# EAGLE design bookie_board (EAGLE 5.06)
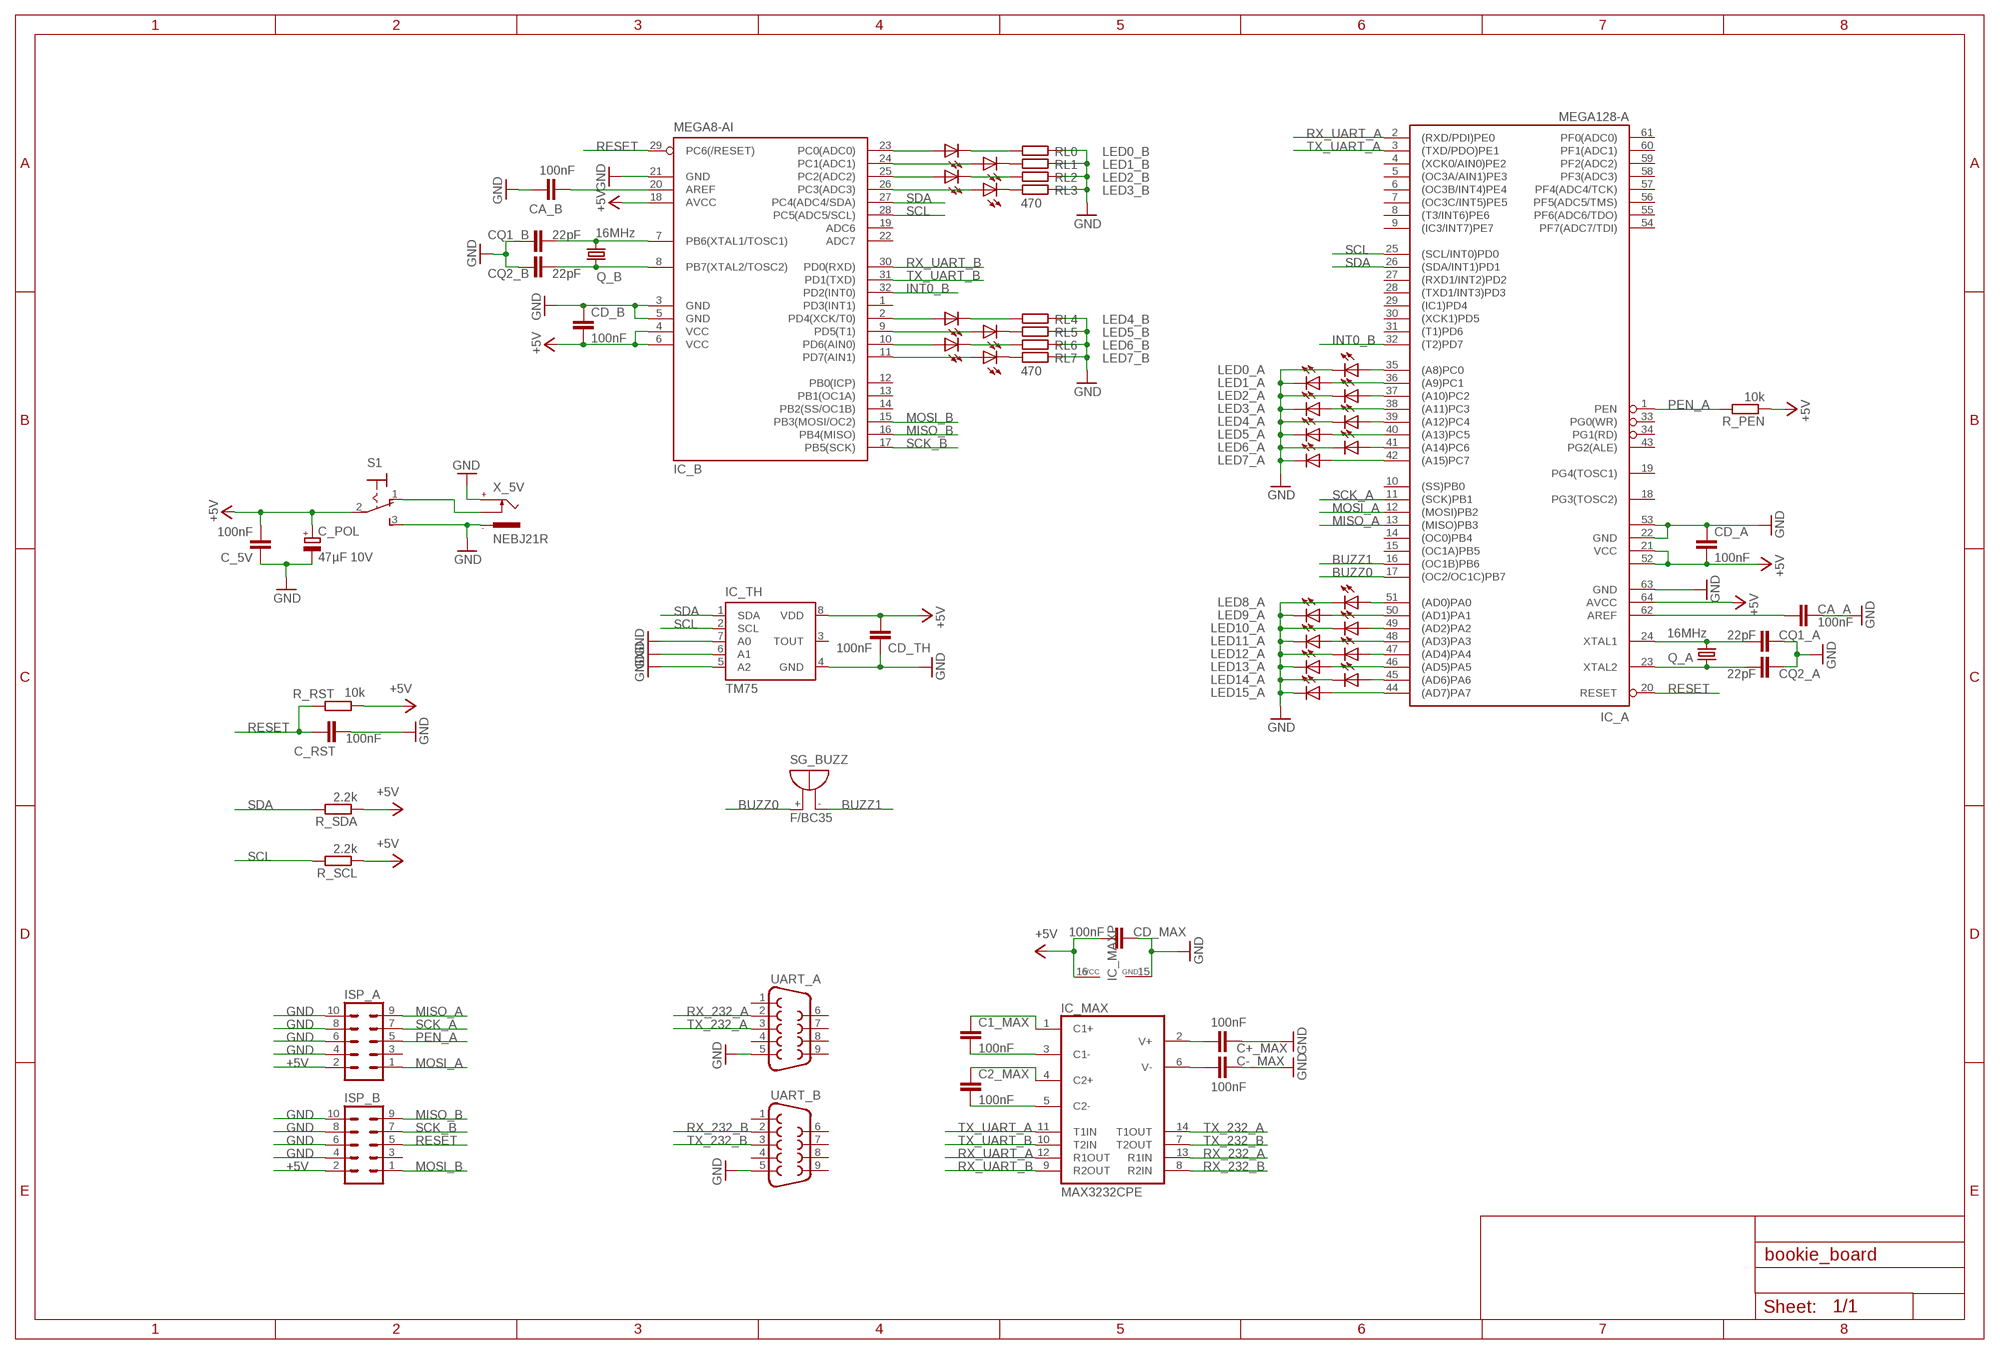
[diagram p0: schematic, sheet 1]

## Parts
C1_MAX  100nF  C-EUC0805  [C0805]
C2_MAX  100nF  C-EUC0805  [C0805]
C+_MAX  100nF  C-EUC0805  [C0805]
C-_MAX  100nF  C-EUC0805  [C0805]
C_5V  100nF  C-EUC0805  [C0805]
C_POL  47µF 10V  CPOL-EUE5-5  [E5-5]
C_RST  100nF  C-EUC0805  [C0805]
CA_A  100nF  C-EUC0805  [C0805]
CA_B  100nF  C-EUC0805  [C0805]
CD_A  100nF  C-EUC0805  [C0805]
CD_B  100nF  C-EUC0805  [C0805]
CD_MAX  100nF  C-EUC0805  [C0805]
CD_TH  100nF  C-EUC0805  [C0805]
CQ1_A  22pF  C-EUC0805  [C0805]
CQ1_B  22pF  C-EUC0805  [C0805]
CQ2_A  22pF  C-EUC0805  [C0805]
CQ2_B  22pF  C-EUC0805  [C0805]
IC_A  MEGA128-A  [TQFP64]
IC_B  MEGA8-AI  [TQFP32-08]
IC_MAX  MAX3232CPE  [DIL16]
IC_TH  DS1621S  [SO08]
ISP_A  ML10L  [ML10L]
ISP_B  ML10L  [ML10L]
LED0_A  LEDCHIPLED_1206  [CHIPLED_1206]
LED0_B  LEDCHIPLED_1206  [CHIPLED_1206]
LED1_A  LEDCHIPLED_1206  [CHIPLED_1206]
LED1_B  LEDCHIPLED_1206  [CHIPLED_1206]
LED2_A  LEDCHIPLED_1206  [CHIPLED_1206]
LED2_B  LEDCHIPLED_1206  [CHIPLED_1206]
LED3_A  LEDCHIPLED_1206  [CHIPLED_1206]
LED3_B  LEDCHIPLED_1206  [CHIPLED_1206]
LED4_A  LEDCHIPLED_1206  [CHIPLED_1206]
LED4_B  LEDCHIPLED_1206  [CHIPLED_1206]
LED5_A  LEDCHIPLED_1206  [CHIPLED_1206]
LED5_B  LEDCHIPLED_1206  [CHIPLED_1206]
LED6_A  LEDCHIPLED_1206  [CHIPLED_1206]
LED6_B  LEDCHIPLED_1206  [CHIPLED_1206]
LED7_A  LEDCHIPLED_1206  [CHIPLED_1206]
LED7_B  LEDCHIPLED_1206  [CHIPLED_1206]
LED8_A  LEDCHIPLED_1206  [CHIPLED_1206]
LED9_A  LEDCHIPLED_1206  [CHIPLED_1206]
LED10_A  LEDCHIPLED_1206  [CHIPLED_1206]
LED11_A  LEDCHIPLED_1206  [CHIPLED_1206]
LED12_A  LEDCHIPLED_1206  [CHIPLED_1206]
LED13_A  LEDCHIPLED_1206  [CHIPLED_1206]
LED14_A  LEDCHIPLED_1206  [CHIPLED_1206]
LED15_A  LEDCHIPLED_1206  [CHIPLED_1206]
Q_A  16MHz  CRYSTALHC49S  [HC49/S]
Q_B  16MHz  CRYSTALHC49S  [HC49/S]
R_PEN  10k  R-EU_M0805  [M0805]
R_RST  10k  R-EU_M0805  [M0805]
R_SCL  2.2k  R-EU_M0805  [M0805]
R_SDA  2.2k  R-EU_M0805  [M0805]
RL0  470  R-EU_M0805  [M0805]
RL1  470  R-EU_M0805  [M0805]
RL2  470  R-EU_M0805  [M0805]
RL3  470  R-EU_M0805  [M0805]
RL4  470  R-EU_M0805  [M0805]
RL5  470  R-EU_M0805  [M0805]
RL6  470  R-EU_M0805  [M0805]
RL7  470  R-EU_M0805  [M0805]
S1  M9040P  [M9040P]
SG_BUZZ  F/BC35  [F/BC35]
UART_A  F09D  [F09D]
UART_B  F09D  [F09D]
X_5V  NEBJ21R  [NEBJ21R]

## Nets
+5V: C_5V.2 C_POL.+ CD_A.1 CD_B.1 CD_MAX.1 CD_TH.2 IC_A.21(VCC) IC_A.52(VCC1) IC_A.64(AVCC) IC_B.4(VCC) IC_B.6(VCC) IC_B.18(AVCC) IC_MAX.16(VCC) IC_TH.8(VDD) ISP_A.2 ISP_B.2 R_PEN.1 R_RST.1 R_SCL.1 R_SDA.1 S1.2(P)
BUZZ0: IC_A.17((OC2/OC1C)PB7) SG_BUZZ.+
BUZZ1: IC_A.16((OC1B)PB6) SG_BUZZ.-
GND: C+_MAX.2 C-_MAX.1 C_5V.1 C_POL.- C_RST.1 CA_A.1 CA_B.2 CD_A.2 CD_B.2 CD_MAX.2 CD_TH.1 CQ1_A.2 CQ1_B.1 CQ2_A.1 CQ2_B.2 IC_A.22(GND) IC_A.53(GND1) IC_A.63(GND) IC_B.3(GND) IC_B.5(GND) IC_B.21(GND) IC_MAX.15(GND) IC_TH.4(GND) IC_TH.5(A2) IC_TH.6(A1) IC_TH.7(A0) ISP_A.4 ISP_A.6 ISP_A.8 ISP_A.10 ISP_B.4 ISP_B.6 ISP_B.8 ISP_B.10 LED0_A.C LED1_A.C LED2_A.C LED3_A.C LED4_A.C LED5_A.C LED6_A.C LED7_A.C LED8_A.C LED9_A.C LED10_A.C LED11_A.C LED12_A.C LED13_A.C LED14_A.C LED15_A.C RL0.1 RL1.1 RL2.1 RL3.1 RL4.1 RL5.1 RL6.1 RL7.1 S1.3(S) UART_A.5 UART_B.5 X_5V.+ X_5V.-
INT0_B: IC_A.32((T2)PD7) IC_B.32(PD2(INT0))
MISO_A: IC_A.13((MISO)PB3) ISP_A.9
MISO_B: IC_B.16(PB4(MISO)) ISP_B.9
MOSI_A: IC_A.12((MOSI)PB2) ISP_A.1
MOSI_B: IC_B.15(PB3(MOSI/OC2)) ISP_B.1
N$1: IC_A.51((AD0)PA0) LED8_A.A
N$2: IC_A.50((AD1)PA1) LED9_A.A
N$3: IC_A.49((AD2)PA2) LED10_A.A
N$4: IC_A.48((AD3)PA3) LED11_A.A
N$5: IC_A.47((AD4)PA4) LED12_A.A
N$6: IC_A.46((AD5)PA5) LED13_A.A
N$7: IC_A.45((AD6)PA6) LED14_A.A
N$8: IC_A.44((AD7)PA7) LED15_A.A
N$9: IC_B.26(PC3(ADC3)) LED3_B.A
N$10: IC_B.25(PC2(ADC2)) LED2_B.A
N$11: IC_B.24(PC1(ADC1)) LED1_B.A
N$12: IC_B.23(PC0(ADC0)) LED0_B.A
N$13: IC_B.2(PD4(XCK/T0)) LED4_B.A
N$14: IC_B.9(PD5(T1)) LED5_B.A
N$15: IC_B.10(PD6(AIN0)) LED6_B.A
N$16: C1_MAX.2 IC_MAX.3(C1-)
N$17: CQ1_A.1 IC_A.24(XTAL1) Q_A.2
N$18: CQ2_A.2 IC_A.23(XTAL2) Q_A.1
N$19: CQ1_B.2 IC_B.7(PB6(XTAL1/TOSC1)) Q_B.2
N$20: CQ2_B.1 IC_B.8(PB7(XTAL2/TOSC2)) Q_B.1
N$21: CA_A.2 IC_A.62(AREF)
N$22: CA_B.1 IC_B.20(AREF)
N$23: LED0_B.C RL0.2
N$24: LED2_B.C RL2.2
N$25: LED1_B.C RL1.2
N$26: LED3_B.C RL3.2
N$27: LED4_B.C RL4.2
N$28: LED5_B.C RL5.2
N$29: LED6_B.C RL6.2
N$30: LED7_B.C RL7.2
N$31: IC_A.40((A13)PC5) LED5_A.A
N$32: IC_A.41((A14)PC6) LED6_A.A
N$33: IC_A.42((A15)PC7) LED7_A.A
N$34: IC_A.38((A11)PC3) LED3_A.A
N$35: IC_A.39((A12)PC4) LED4_A.A
N$36: IC_A.37((A10)PC2) LED2_A.A
N$37: IC_A.36((A9)PC1) LED1_A.A
N$38: IC_A.35((A8)PC0) LED0_A.A
N$39: C1_MAX.1 IC_MAX.1(C1+)
N$40: C2_MAX.2 IC_MAX.5(C2-)
N$41: C2_MAX.1 IC_MAX.4(C2+)
N$42: C+_MAX.1 IC_MAX.2(V+)
N$43: C-_MAX.2 IC_MAX.6(V-)
N$44: S1.1(O) X_5V.C
N$46: IC_B.11(PD7(AIN1)) LED7_B.A
PEN_A: IC_A.1(PEN) ISP_A.5 R_PEN.2
RESET: C_RST.2 IC_A.20(RESET) IC_B.29(PC6(/RESET)) ISP_B.5 R_RST.2
RX_232_A: IC_MAX.13(R1IN) UART_A.2
RX_232_B: IC_MAX.8(R2IN) UART_B.2
RX_UART_A: IC_A.2((RXD/PDI)PE0) IC_MAX.12(R1OUT)
RX_UART_B: IC_B.30(PD0(RXD)) IC_MAX.9(R2OUT)
SCK_A: IC_A.11((SCK)PB1) ISP_A.7
SCK_B: IC_B.17(PB5(SCK)) ISP_B.7
SCL: IC_A.25((SCL/INT0)PD0) IC_B.28(PC5(ADC5/SCL)) IC_TH.2(SCL) R_SCL.2
SDA: IC_A.26((SDA/INT1)PD1) IC_B.27(PC4(ADC4/SDA)) IC_TH.1(SDA) R_SDA.2
TX_232_A: IC_MAX.14(T1OUT) UART_A.3
TX_232_B: IC_MAX.7(T2OUT) UART_B.3
TX_UART_A: IC_A.3((TXD/PDO)PE1) IC_MAX.11(T1IN)
TX_UART_B: IC_B.31(PD1(TXD)) IC_MAX.10(T2IN)
Unconnected: IC_A.4((XCK0/AIN0)PE2) IC_A.5((OC3A/AIN1)PE3) IC_A.6((OC3B/INT4)PE4) IC_A.7((OC3C/INT5)PE5) IC_A.8((T3/INT6)PE6) IC_A.9((IC3/INT7)PE7) IC_A.10((SS)PB0) IC_A.14((OC0)PB4) IC_A.15((OC1A)PB5) IC_A.18(PG3(TOSC2)) IC_A.19(PG4(TOSC1)) IC_A.27((RXD1/INT2)PD2) IC_A.28((TXD1/INT3)PD3) IC_A.29((IC1)PD4) IC_A.30((XCK1)PD5) IC_A.31((T1)PD6) IC_A.33(PG0(WR)) IC_A.34(PG1(RD)) IC_A.43(PG2(ALE)) IC_A.54(PF7(ADC7/TDI)) IC_A.55(PF6(ADC6/TDO)) IC_A.56(PF5(ADC5/TMS)) IC_A.57(PF4(ADC4/TCK)) IC_A.58(PF3(ADC3)) IC_A.59(PF2(ADC2)) IC_A.60(PF1(ADC1)) IC_A.61(PF0(ADC0)) IC_B.1(PD3(INT1)) IC_B.12(PB0(ICP)) IC_B.13(PB1(OC1A)) IC_B.14(PB2(SS/OC1B)) IC_B.19(ADC6) IC_B.22(ADC7) IC_TH.3(TOUT) ISP_A.3 ISP_B.3 UART_A.1 UART_A.4 UART_A.6 UART_A.7 UART_A.8 UART_A.9 UART_B.1 UART_B.4 UART_B.6 UART_B.7 UART_B.8 UART_B.9

## Notes on the sheet
- TM75

## Library data of the parts
C1_MAX C2_MAX C+_MAX C-_MAX C_5V C_RST CA_A CA_B CD_A CD_B CD_MAX CD_TH CQ1_A CQ1_B CQ2_A CQ2_B = rcl:C-EU: CAPACITOR, European symbol
C_POL = rcl:CPOL-EU: POLARIZED CAPACITOR, European symbol
IC_A = atmel:MEGA128: MICROCONTROLLER 128 Kbytes FLASH 4 Kbytes SRAM 4 Kbytes EEPROM DUAL USART 8-channel 10 bit ADC Source: avr.lbr
IC_B = atmel:MEGA8: MICROCONTROLLER 8 Kbytes FLASH, 1 kbytes SRAM, 512 bytes EEPROM, USART, 6-channel 10 bit ADC, 2-channel 8 bit ADC Pin compatible with Atmega48, ATMega88, ATMega168 Source: avr.lbr
IC_MAX = maxim:MAX3232*: True RS-232 Transceivers 3.0V to 5.5V, Low-Power up to 1Mbps, Using Four 0.1µF External Capacitors Source: http://pdfserv.maxim-ic.com/en/ds/MAX3222-MAX3241.pdf
IC_TH = maxim:DS1621: Digital Thermometer and Thermostat Source: http://pdfserv.maxim-ic.com/en/ds/DS1621.pdf
ISP_A ISP_B = con-harting-ml:ML10: HARTING
LED0_A LED0_B LED1_A LED1_B LED2_A LED2_B LED3_A LED3_B LED4_A LED4_B LED5_A LED5_B LED6_A LED6_B LED7_A LED7_B LED8_A LED9_A LED10_A LED11_A LED12_A LED13_A LED14_A LED15_A = led:LED: LED OSRAM: - CHIPLED LG R971, LG N971, LY N971, LG Q971, LY Q971, LO R971, LY R971 LH N974, LH R974 LS Q976, LO Q976, LY Q976 LO Q996 - Hyper CHIPLED LW Q18S LB Q993, LB Q99A, LB R99A - SideLED LS A670, LO A670, LY A670, LG A670, LP A670 LB A673, LV A673, LT A673, LW A673 LH A674 LY A675 LS A676, LA A676, LO A676, LY A676, LW A676 LS A679, LY A679, LG A679 - Hyper Micro SIDELED® LS Y876, LA Y876, LO Y876, LY Y876 LT Y87S - SmartLED LW L88C, LW L88S LB L89C, LB L89S, LG L890 LS L89K, LO L89K, LY L89K LS L896, LA L896, LO L896, LY L896 - TOPLED LS T670, LO T670, LY T670, LG T670, LP T670 LSG T670, LSP T670, LSY T670, LOP T670, LYG T670 LG T671, LOG T671, LSG T671 LB T673, LV T673, LT T673, LW T673 LH T674 LS T676, LA T676, LO T676, LY T676, LB T676, LH T676, LSB T676, LW T676 LB T67C, LV T67C, LT T67C, LS T67K, LO T67K, LY T67K, LW E67C LS E67B, LA E67B, LO E67B, LY E67B, LB E67C, LV E67C, LT E67C LW T67C LS T679, LY T679, LG T679 LS T770, LO T770, LY T770, LG T770, LP T770 LB T773, LV T773, LT T773, LW T773 LH T774 LS E675, LA E675, LY E675, LS T675 LS T776, LA T776, LO T776, LY T776, LB T776 LHGB T686 LT T68C, LB T68C - Hyper Mini TOPLED® LB M676 - Mini TOPLED Santana® LG M470 LS M47K, LO M47K, LY M47K Source: http://www.osram.convergy.de LUXEON: - LUMILED® LXK2-PW12-R00, LXK2-PW12-S00, LXK2-PW14-U00, LXK2-PW14-V00 LXK2-PM12-R00, LXK2-PM12-S00, LXK2-PM14-U00 LXK2-PE12-Q00, LXK2-PE12-R00, LXK2-PE12-S00, LXK2-PE14-T00, LXK2-PE14-U00 LXK2-PB12-K00, LXK2-PB12-L00, LXK2-PB12-M00, LXK2-PB14-N00, LXK2-PB14-P00, LXK2-PB14-Q00 LXK2-PR12-L00, LXK2-PR12-M00, LXK2-PR14-Q00, LXK2-PR14-R00 LXK2-PD12-Q00, LXK2-PD12-R00, LXK2-PD12-S00 LXK2-PH12-R00, LXK2-PH12-S00 LXK2-PL12-P00, LXK2-PL12-Q00, LXK2-PL12-R00 Source: www.luxeon.com KINGBRIGHT: KA-3528ASYC Source: www.kingbright.com
Q_A Q_B = crystal:CRYSTAL: CRYSTAL
R_PEN R_RST R_SCL R_SDA RL0 RL1-RL7 = rcl:R-EU_: RESISTOR, European symbol
S1 = switch:M9040P: TOGGLE SWITCH Marquardt
SG_BUZZ = buzzer:F/BC35: BUZZER Source: Spoerle
UART_A UART_B = con-subd:F09: SUB-D
X_5V = con-lumberg:NEBJ21R: Klinkeneinbaukupplung

## Board
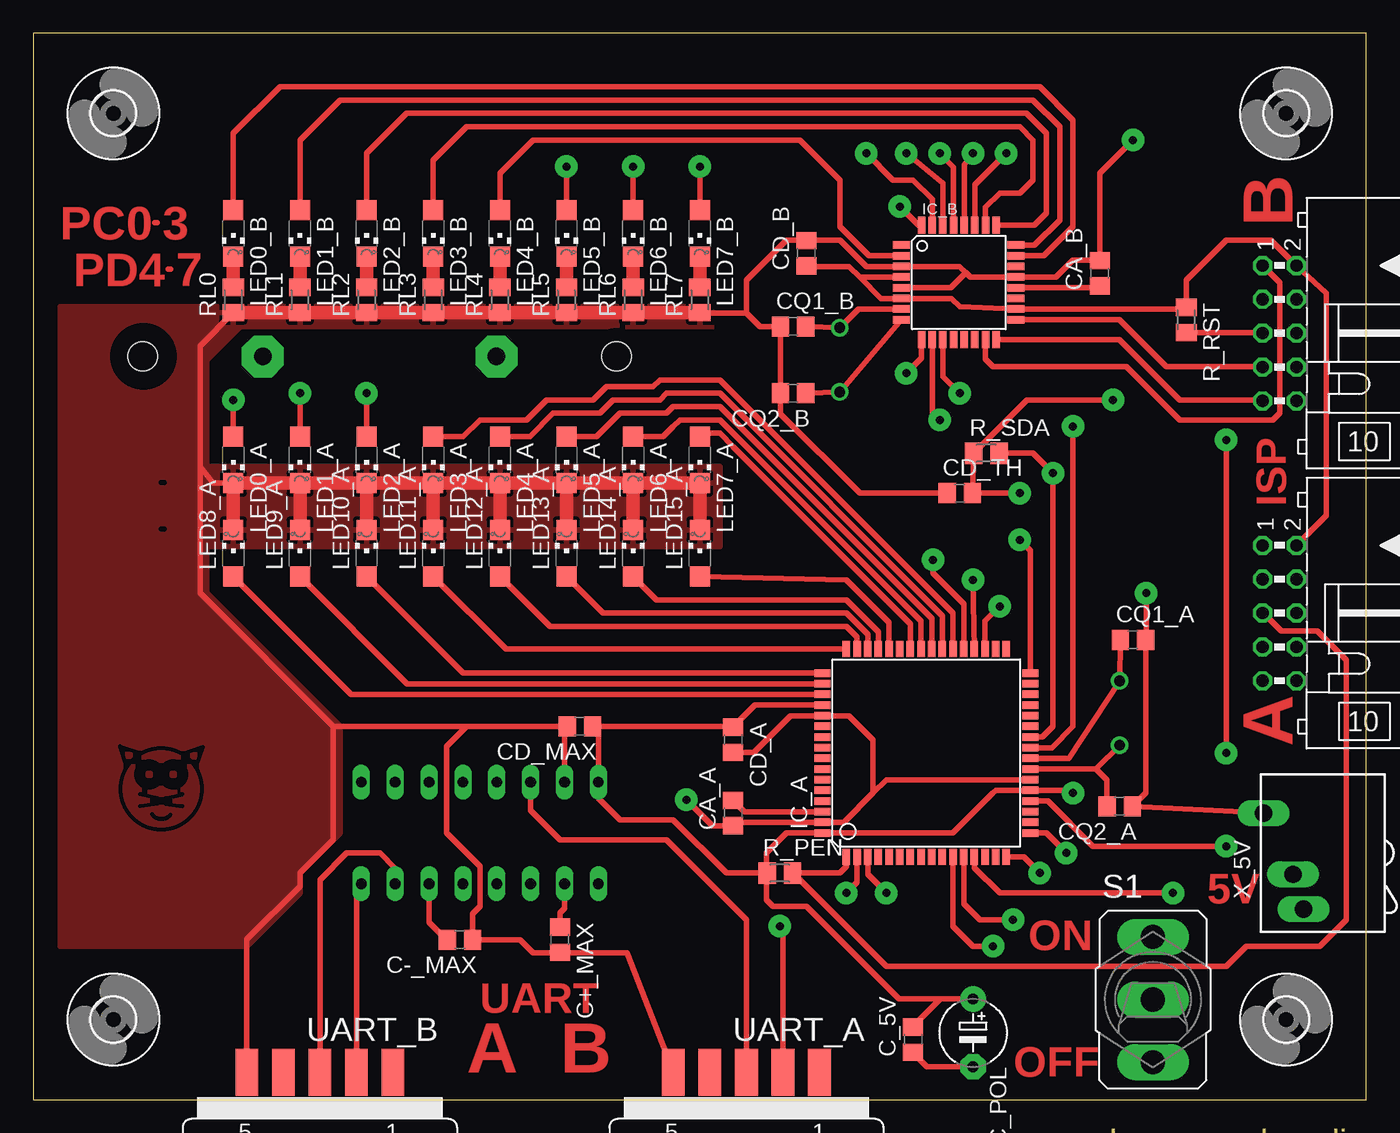
[diagram p1: board, top side]
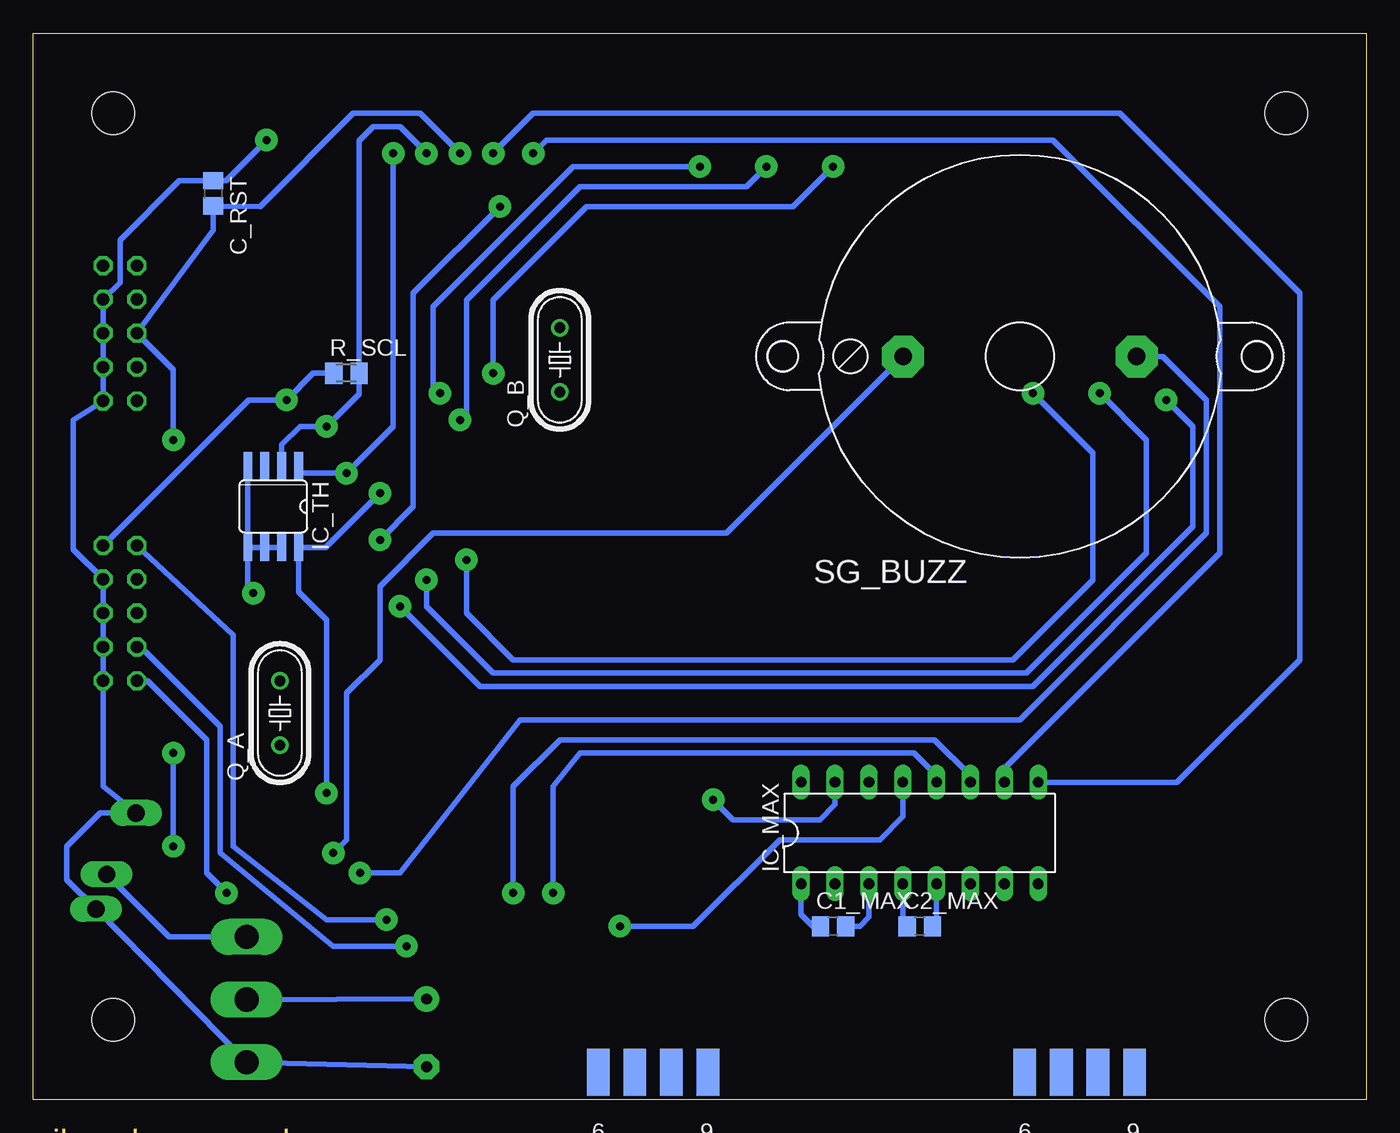
[diagram p2: board, bottom side, seen from below]

Size 100 x 80 mm. Coordinates in mm from the lower left corner, seen from the top.
Outline: 0,0 100,0 100,80 0,80 0,0
Copper layers (1*16): Top 0.035mm / dielectric 1.5mm / Bottom 0.035mm
Design rules "default": minimum track width 10mil, minimum drill 24mil, track to track 8mil, track to pad 8mil, pad to pad 8mil, via to via 8mil, smd to smd 8mil, copper to edge 40mil, drill to drill 8mil, minimum pad ring 10mil, minimum via ring 8mil, stop-mask expansion 4mil, vias tented up to drill 0mil, thermal gap 10mil
tRestrict: area 6.6,20.3 to 12.6,26.3; area 8,23.7 to 9.4,25.1; area 9.8,23.7 to 11.2,25.1; area 7.3,54.8 to 9.3,56.8; 11 lines

### Footprints (pad centres in the part's own frame; a part is rotated, then mirrored left to right if it is on the bottom)
C0805 = smd 1.3 x 1.5: 1 -0.95,0; 2 0.95,0
E5-5 = drill 0.813 pad 1.905 round: + -2.54,0 | drill 0.813 pad 1.905 octagon: - 2.54,0
TQFP64 = smd 1.194 x 0.559: 1 -7.8,6; 2 -7.8,5.2; 3 -7.8,4.4; 4 -7.8,3.6; 5 -7.8,2.8; 6 -7.8,2; 7 -7.8,1.2; 8 -7.8,0.4; 9 -7.8,-0.4; 10 -7.8,-1.2; 11 -7.8,-2; 12 -7.8,-2.8; 13 -7.8,-3.6; 14 -7.8,-4.4; 15 -7.8,-5.2; 16 -7.8,-6; 33 7.8,-6; 34 7.8,-5.2; 35 7.8,-4.4; 36 7.8,-3.6; 37 7.8,-2.8; 38 7.8,-2; 39 7.8,-1.2; 40 7.8,-0.4; 41 7.8,0.4; 42 7.8,1.2; 43 7.8,2; 44 7.8,2.8; 45 7.8,3.6; 46 7.8,4.4; 47 7.8,5.2; 48 7.8,6 | smd 0.559 x 1.194: 17 -6,-7.8; 18 -5.2,-7.8; 19 -4.4,-7.8; 20 -3.6,-7.8; 21 -2.8,-7.8; 22 -2,-7.8; 23 -1.2,-7.8; 24 -0.4,-7.8; 25 0.4,-7.8; 26 1.2,-7.8; 27 2,-7.8; 28 2.8,-7.8; 29 3.6,-7.8; 30 4.4,-7.8; 31 5.2,-7.8; 32 6,-7.8; 49 6,7.8; 50 5.2,7.8; 51 4.4,7.8; 52 3.6,7.8; 53 2.8,7.8; 54 2,7.8; 55 1.2,7.8; 56 0.4,7.8; 57 -0.4,7.8; 58 -1.2,7.8; 59 -2,7.8; 60 -2.8,7.8; 61 -3.6,7.8; 62 -4.4,7.8; 63 -5.2,7.8; 64 -6,7.8
TQFP32-08 = smd 1.27 x 0.559: 1 -4.293,2.8; 2 -4.293,2; 3 -4.293,1.2; 4 -4.293,0.4; 5 -4.293,-0.4; 6 -4.293,-1.2; 7 -4.293,-2; 8 -4.293,-2.8; 17 4.293,-2.8; 18 4.293,-2; 19 4.293,-1.2; 20 4.293,-0.4; 21 4.293,0.4; 22 4.293,1.2; 23 4.293,2; 24 4.293,2.8 | smd 0.559 x 1.27: 9 -2.8,-4.293; 10 -2,-4.293; 11 -1.2,-4.293; 12 -0.4,-4.293; 13 0.4,-4.293; 14 1.2,-4.293; 15 2,-4.293; 16 2.8,-4.293; 25 2.8,4.293; 26 2,4.293; 27 1.2,4.293; 28 0.4,4.293; 29 -0.4,4.293; 30 -1.2,4.293; 31 -2,4.293; 32 -2.8,4.293
DIL16 = drill 0.813 long: 1 -8.89,-3.81; 2 -6.35,-3.81; 3 -3.81,-3.81; 4 -1.27,-3.81; 5 1.27,-3.81; 6 3.81,-3.81; 7 6.35,-3.81; 8 8.89,-3.81; 9 8.89,3.81; 10 6.35,3.81; 11 3.81,3.81; 12 1.27,3.81; 13 -1.27,3.81; 14 -3.81,3.81; 15 -6.35,3.81; 16 -8.89,3.81
SO08 = smd 0.66 x 2.032: 1 -1.905,-3.073; 2 -0.635,-3.073; 3 0.635,-3.073; 4 1.905,-3.073; 5 1.905,3.073; 6 0.635,3.073; 7 -0.635,3.073; 8 -1.905,3.073
ML10L = drill 0.914 octagon: 1 -5.08,-1.27; 2 -5.08,1.27; 3 -2.54,-1.27; 4 -2.54,1.27; 5 0,-1.27; 6 0,1.27; 7 2.54,-1.27; 8 2.54,1.27; 9 5.08,-1.27; 10 5.08,1.27
CHIPLED_1206 = smd 1.5 x 1.5: A 0,-1.75; C 0,1.75
HC49/S = drill 0.813 round: 1 -2.413,0; 2 2.413,0
M0805 = smd 1.3 x 1.6: 1 -0.95,0; 2 0.95,0
M9040P = drill 1.803 long: 1 0,4.699; 2 0,0; 3 0,-4.699
F/BC35 = drill 1.321 pad 3.15 octagon: + 8.763,0; - -8.763,0 | hole 2.21: 17.78,0; -17.78,0
3,2 = hole 3.2: 0,0
F09D = smd 1.7 x 3.5: 1 -5.486,-6.045; 2 -2.743,-6.045; 3 0,-6.045; 4 2.743,-6.045; 5 5.486,-6.045 | smd 1.7 x 3.5 bottom: 6 -4.115,-6.045; 7 -1.372,-6.045; 8 1.372,-6.045; 9 4.115,-6.045
NEBJ21R = drill 1.3 pad 1.905 long: + 4.2,-6.2; - -3,-9.2; C 1.6,-7

### Placement (x,y rotation side)
C1_MAX  40,13 0 bottom
C2_MAX  33.5,13 0 bottom
C+_MAX  39.5,12 270 top
C-_MAX  32,12 180 top
C_5V  66,4.5 90 top
C_POL  70.5,5 270 top
C_RST  86.5,68 270 bottom
CA_A  52.5,21.5 90 top
CA_B  80,62 90 top
CD_A  52.5,27 270 top
CD_B  58,63.5 90 top
CD_MAX  41,28 180 top
CD_TH  69.5,45.5 0 top
CQ1_A  82.5,34.5 0 top
CQ1_B  57,58 0 top
CQ2_A  81.5,22 180 top
CQ2_B  57,53 180 top
IC_A  67,26 90 top
IC_B  69.44,61.31 0 top
IC_MAX  33.5,20 0 bottom
IC_TH  82,44.5 180 bottom
ISP_A  93.5,36.5 270 top
ISP_B  93.5,57.5 270 top
LED0_A  15,48 180 top
LED0_B  15,65 180 top
LED1_A  20,48 180 top
LED1_B  20,65 180 top
LED2_A  25,48 180 top
LED2_B  25,65 180 top
LED3_A  30,48 180 top
LED3_B  30,65 180 top
LED4_A  35,48 180 top
LED4_B  35,65 180 top
LED5_A  40,48 180 top
LED5_B  40,65 180 top
LED6_A  45,48 180 top
LED6_B  45,65 180 top
LED7_A  50,48 180 top
LED7_B  50,65 180 top
LED8_A  15,41 0 top
LED9_A  20,41 0 top
LED10_A  25,41 0 top
LED11_A  30,41 0 top
LED12_A  35,41 0 top
LED13_A  40,41 0 top
LED14_A  45,41 0 top
LED15_A  50,41 0 top
Q_A  81.5,29 90 bottom
Q_B  60.5,55.5 90 bottom
R_PEN  56,17 0 top
R_RST  86.5,58.5 270 top
R_SCL  76.5,54.5 0 bottom
R_SDA  71.5,48.5 0 top
RL0  15,60 90 top
RL1  20,60 90 top
RL2  25,60 90 top
RL3  30,60 90 top
RL4  35,60 90 top
RL5  40,60 90 top
RL6  45,60 90 top
RL7  50,60 90 top
S1  84,7.5 0 top
SG_BUZZ  25.98,55.76 180 bottom
U$1  [3,2]  6,6 0 top
U$2  [3,2]  94,6 0 top
U$3  [3,2]  94,74 0 top
U$4  [3,2]  6,74 180 top
UART_A  53.5,-4 180 top
UART_B  21.5,-4 180 top
X_5V  101.5,18.5 270 top

### Tracks (layer width: path | path; a pad name or v marks a point on that pad's centre or on a via)
+5V  (via drill 0.6 pad 1.68)
  Top 0.4: 94.92,62.58 ISP_B.2 92.85,64.5 89.5,64.5 86.5,61.5 R_RST.1 arc-90 86.36,59.31 IC_B.18 69.5,59.5 68.89,60.11 IC_B.6 63.6,60.11 62,61.71 IC_B.4 | CD_MAX.1 42.39,27.56 IC_MAX.16 42.39,22.61 44,21 48,21 52,17 55,17 | ISP_A.2 97,43.81 97,60.5 | IC_A.52 54.15,29.6 CD_A.1 | IC_A.64 69,20 72,23 | C_POL.+ 64.96,7.54 58,14.5
  Top 0.406: 97,60.5 ISP_B.2 | v74,45.5 CD_TH.2 R_SDA.1 74.55,52.5 v81,52.5 | CD_A.1 52.45,28 CD_MAX.1 | C_5V.2 66,5.5 68.04,7.54 C_POL.+ | CD_B.1 58,62.5 61.21,62.5 62,61.71 | 72,23 72.2,23.2 IC_A.21 77.8,23.2 v78,23 | 58,14.5 55.5,14.5 55,15 55,17 | IC_A.64 56.5,20 55,18.5 55,17 | 55,17 R_PEN.1
  Bottom 0.4: v78,23 78,36
  Bottom 0.406: C_POL.+ S1.2 | 78,36 80.09,38.09 IC_TH.8 78.07,41.43 v74,45.5 | R_SCL.1 79,54.5 v81,52.5 83.85,52.5 ISP_A.2
BUZZ0  (via drill 0.6 pad 1.68)
  Top 0.4: IC_A.17 76,20 v77.5,18.5
  Bottom 0.4: SG_BUZZ.+ 48,42.5 70,42.5 74,38.5 74,33 76.5,30.5 76.5,19.5 v77.5,18.5
BUZZ1  (via drill 0.6 pad 1.68)
  Top 0.4: IC_A.16 74.3,18.2 v75.5,17
  Bottom 0.4: SG_BUZZ.- 15.26,55.76 12,52.5 12,42.5 26,28.5 63.5,28.5 72.5,17 v75.5,17
GND  (via drill 0.6 pad 1.68)
  Top 0.4: IC_B.21 76.71,61.71 78,63 79.95,63 CA_B.2 80,69.5 v82.5,72 | IC_MAX.15 39.85,27.8 CD_MAX.2 32.5,28 22.5,28 12.5,38 12.5,47.5 | IC_B.5 68.86,60.91 69.97,62.03 70,62.06 | 62.99,62.51 IC_B.3 | IC_A.53 57.3,28.8 | 12.5,47.5 13.5,46.25 LED0_A.C | RL0.1 12.5,56.55 12.5,47.5 | 63,23 60.8,20.8 IC_A.63 52.75,20.8 CA_A.1 50.95,20.55 v49,22.5 | 63,23 63,27 | IC_A.22 64,24 63,23 | 31,20 33.5,17.5 | 22.5,19.5 20,17 20,16 16.01,12.01 UART_B.5
  Top 0.406: X_5V.- CQ2_A.1 83.45,23 CQ1_A.2 83.5,34.55 v83.5,38 | CD_TH.1 62,45.5 56.05,51.45 CQ2_B.2 CQ1_B.1 54.5,58 53.5,59 | 22.5,19.5 22.5,28 | C_5V.1 66,3.5 67.04,2.46 C_POL.- | UART_A.5 44.56,11 39.5,11 C+_MAX.2 39.45,11 37.5,11 36.5,12 C-_MAX.1 32.95,13.95 33.5,14.5 33.5,17.5 | 31,20 31,26.5 32.5,28 | RL7.1 50.05,59 53.5,59 | 53.5,59 53.5,61.5 56.5,64.5 57.95,64.5 CD_B.2 58,64.5 60.5,64.5 62.5,62.5 62.98,62.5 62.99,62.51 | IC_B.21 70.29,61.71 70,62 | 70,62 69.97,62.03 | IC_B.3 69.49,62.51 70,62 | CD_A.2 54.05,26.05 56.8,28.8 57.3,28.8 | IC_A.53 61.2,28.8 63,27
  Top 1.016: RL0.1 RL1.1 RL2.1 RL3.1 RL4.1 RL5.1 RL6.1 RL7.1 | LED8_A.C LED0_A.C LED1_A.C | LED1_A.C LED9_A.C | LED2_A.C LED10_A.C | LED3_A.C LED11_A.C | LED4_A.C LED12_A.C | LED5_A.C LED13_A.C | LED6_A.C LED14_A.C | LED1_A.C LED2_A.C | LED2_A.C LED3_A.C | LED3_A.C LED4_A.C | LED4_A.C LED5_A.C | LED5_A.C LED6_A.C | LED6_A.C LED7_A.C LED15_A.C
  Bottom 0.4: 93.5,64.5 93.5,61.31 ISP_B.4 | C_RST.1 85.55,68.95 v82.5,72 | ISP_A.10 94.77,23.5 | IC_MAX.15 39.85,22.15 41,21 47.5,21 v49,22.5
  Bottom 0.406: C_POL.- S1.3 X_5V.+ 97.5,16.5 97.5,19 95,21.5 X_5V.- 94.77,23.5 | ISP_B.4 ISP_B.6 ISP_B.8 ISP_B.10 97,51 97,41.27 ISP_A.4 ISP_A.6 ISP_A.8 ISP_A.10 | C_RST.1 89.05,68.95 93.5,64.5 | 83.91,42 IC_TH.5 IC_TH.6 IC_TH.7 | 83.91,42 IC_TH.4 | v83.5,38 83.91,38.41 83.91,42
  pour Top: 2,11.5 16,11.5 20,15.5 20,17 23,20 23,28 13,38 13,41.5 51.5,41.5 51.5,47.5 13,47.5 13,55.5 15.5,58 51,58 51,59.5 2,59.5
INT0_B  (via drill 0.6 pad 1.68)
  Top 0.406: IC_B.32 66.4,65.6 v65,67 | IC_A.32 74.8,41.2 v74,42
  Bottom 0.406: v65,67 71.5,60.5 71.5,44.5 v74,42
MISO_A  (via drill 0.6 pad 1.68)
  Top 0.4: IC_A.13 70.6,17.4 72.5,15.5 v85.5,15.5
  Bottom 0.406: v85.5,15.5 87,17 87,27 91.42,31.42 ISP_A.9
MISO_B
  Top 0.4: IC_B.16 81.48,57.02 86,52.5 92.15,52.5 ISP_B.9
MOSI_A  (via drill 0.6 pad 1.68)
  Top 0.4: IC_A.12 69.8,14.7 71,13.5 v73.5,13.5
  Bottom 0.4: v73.5,13.5 78,13.5
  Bottom 0.406: 78,13.5 85,19 85,34.85 ISP_A.1
MOSI_B
  Top 0.4: IC_B.15 71.44,55.56 72,55 82,55 86,51 93,51 93.5,51.5 93.5,61.31 ISP_B.1
N$1
  Top 0.4: IC_A.51 23.85,30.4 LED8_A.A
N$2
  Top 0.4: IC_A.50 28.05,31.2 LED9_A.A
N$3
  Top 0.4: IC_A.49 32.25,32 LED10_A.A
N$4
  Top 0.4: IC_A.48 35.45,33.8 LED11_A.A
N$5
  Top 0.4: IC_A.47 61.8,34.7 61,35.5 38.75,35.5 LED12_A.A
N$6
  Top 0.4: IC_A.46 62.6,34.9 61,36.5 42.75,36.5 LED13_A.A
N$7
  Top 0.4: IC_A.45 63.4,35.1 61,37.5 46.75,37.5 LED14_A.A
N$8
  Top 0.4: IC_A.44 64.2,35.8 61,39 LED15_A.A
N$9
  Top 0.4: LED3_B.A 30,70.5 32.5,73 74,73 75,72 75,69 74,68 72.5,68 71.44,66.94 IC_B.26
N$10
  Top 0.4: LED2_B.A 25,71 28,74 74.5,74 76,72.5 76,66.5 75.1,65.6 IC_B.25
N$11
  Top 0.4: LED1_B.A 20,72 23,75 75,75 77,73 77,66 75.11,64.11 IC_B.24
N$12
  Top 0.4: IC_B.23 75.81,63.31 78,65.5 78,73.5 75.5,76 18.5,76 15,72.5 LED0_B.A
N$13
  Top 0.4: 57.5,72 37.5,72 35,69.5 LED4_B.A
  Top 0.406: IC_B.2 62.69,63.31 60.5,65.5 60.5,69 57.5,72
N$14  (via drill 0.6 pad 1.68)
  Top 0.4: IC_B.9 66.64,55.64 v65.5,54.5 | LED5_B.A v40,70
  Bottom 0.4: v65.5,54.5 65.5,60 58.5,67 43,67 v40,70
N$15  (via drill 0.6 pad 1.68)
  Top 0.4: IC_B.10 67.44,51.44 v68,51 | LED6_B.A v45,70
  Bottom 0.4: 59,68.5 67.5,60 67.5,51.5 v68,51
  Bottom 0.406: 59,68.5 46.5,68.5 v45,70
N$16
  Bottom 0.4: C1_MAX.2 38,13 37.31,13.69 IC_MAX.3
N$17
  Top 0.4: CQ1_A.1 Q_A.2 77.69,25.6 IC_A.24
N$18
  Top 0.406: IC_A.23 79.71,24.8 | 79.71,24.8 Q_A.1 | CQ2_A.2 80.55,23.96 79.71,24.8
N$19
  Top 0.4: CQ1_B.2 Q_B.2 61.9,59.31 IC_B.7
N$20
  Top 0.4: IC_B.8 Q_B.1 CQ2_B.1
N$21
  Top 0.4: IC_A.62 53.35,21.6 CA_A.2
N$22
  Top 0.4: IC_B.20 79.86,60.91 CA_B.1
N$23
  Top 1.016: RL0.2 LED0_B.C
N$24
  Top 1.016: RL2.2 LED2_B.C
N$25
  Top 1.016: RL1.2 LED1_B.C
N$26
  Top 1.016: RL3.2 LED3_B.C
N$27
  Top 1.016: RL4.2 LED4_B.C
N$28
  Top 1.016: RL5.2 LED5_B.C
N$29
  Top 1.016: RL6.2 LED6_B.C
N$30
  Top 1.016: RL7.2 LED7_B.C
N$31
  Top 0.4: IC_A.40 67.4,36.1 51.5,52
  Top 0.406: 51.5,52 48,52 47.5,51.5 44,51.5 42.25,49.75 LED5_A.A 40,49.5
N$32
  Top 0.4: IC_A.41 66.6,35.9 51.5,51
  Top 0.406: 51.5,51 48.5,51 48,50.5 47.5,50 47.25,49.75 LED6_A.A 45,49.5
N$33
  Top 0.4: IC_A.42 65.8,35.7 52.5,49
  Top 0.406: LED7_A.A 50,50 51.5,50 52.5,49
N$34
  Top 0.4: IC_A.38 69,36.5 51.5,54
  Top 0.406: 30,49.5 LED3_A.A 32.25,49.75 33.5,51 37,51 38.5,52.5 42,52.5 43,53.5 46.5,53.5 47,54 51.5,54
N$35
  Top 0.4: IC_A.39 68.2,36.3 51.5,53
  Top 0.406: 35,49.5 LED4_A.A 37.25,49.75 39,51.5 42.5,51.5 43.5,52.5 47,52.5 47.5,53 51.5,53
N$36  (via drill 0.6 pad 1.68)
  Top 0.4: 69.8,37.2 IC_A.37 | v25,53 LED2_A.A
  Top 0.406: 69.8,37.2 67.5,39.5 v67.5,40.5
  Bottom 0.4: v25,53 20.5,48.5 20.5,39 26.5,33 64,33 67.5,36.5 v67.5,40.5
N$37  (via drill 0.6 pad 1.68)
  Top 0.4: v20,53 LED1_A.A | v70.5,39 IC_A.36
  Bottom 0.4: v20,53 16.5,49.5 16.5,41 25.5,32 65.5,32 70.5,37 v70.5,39
N$38  (via drill 0.6 pad 1.68)
  Top 0.4: IC_A.35 71.4,35.9 v72.5,37 | v15,52.5 LED0_A.A
  Bottom 0.4: v15,52.5 13,50.5 13,43 25,31 66.5,31 v72.5,37
N$39
  Bottom 0.4: C1_MAX.1 41.5,13 42.39,13.89 IC_MAX.1
N$40
  Bottom 0.4: C2_MAX.2 32.5,13 32.23,13.27 IC_MAX.5
N$41
  Bottom 0.4: C2_MAX.1 34.5,13 34.77,13.27 IC_MAX.4
N$42
  Top 0.406: IC_MAX.2 39.85,14.35 39.5,14 C+_MAX.1
N$43
  Top 0.406: C-_MAX.2 31,12 29.69,13.31 IC_MAX.6
N$44
  Bottom 0.406: S1.1 89.8,12.2 X_5V.C
N$46  (via drill 0.6 pad 1.68)
  Top 0.4: LED7_B.A 50,66.5 v50,70 | IC_B.11 68.24,54.26 v69.5,53
  Bottom 0.4: v50,70 59.5,70 70,59.5 70,53.5 v69.5,53
N$47
  Top 0.4: 9.3,65.8 9.1,65.8
N$49
  Top 0.4: 10.1,62.3 10.3,62.3
PEN_A
  Top 0.4: 98.5,33 98.5,13.5 96.5,11.5 91,11.5 89.5,10 64.5,10
  Top 0.406: 98.5,33 96.34,35.16 93.62,35.16 92.29,36.5 ISP_A.5 | IC_A.1 61,17.5 60.5,17 57,17 | R_PEN.2 57,17 | 64.5,10 64,10 57,17
RESET  (via drill 0.6 pad 1.68)
  Top 0.4: R_RST.2 92.18,57.55 arc-90 ISP_B.5 | IC_B.29 69.04,69.96 v68,71 | IC_A.20 76.1,22.4 79.5,19 v89.5,19
  Top 0.406: v89.5,26 v89.5,49.5
  Bottom 0.4: v68,71 71,74 76,74 83,67 C_RST.2 86.5,65.23 ISP_B.5
  Bottom 0.406: ISP_B.5 89.5,54.77 v89.5,49.5 | v89.5,19 v89.5,26
RX_232_A  (via drill 0.6 pad 1.68)
  Top 0.4: UART_A.2 56.24,12.76 v56,13
  Bottom 0.4: IC_MAX.13 34.77,21.23 36.5,19.5 44,19.5 50.5,13 v56,13
RX_232_B
  Top 0.4: UART_B.2 24.24,15.82 IC_MAX.8
RX_UART_A  (via drill 0.6 pad 1.68)
  Top 0.4: IC_A.2 61.8,16.3 v61,15.5
  Bottom 0.4: v61,15.5 61,23.5 59,26 33.92,26
  Bottom 0.406: 33.92,26 32.23,24.31 IC_MAX.12
RX_UART_B  (via drill 0.6 pad 1.68)
  Top 0.4: IC_B.30 68.24,68.76 v65.5,71
  Bottom 0.4: 5,33 5,60.5 18.5,74 62.5,74 v65.5,71
  Bottom 0.406: 5,33 14.19,23.81 IC_MAX.9
SCK_A  (via drill 0.6 pad 1.68)
  Top 0.406: IC_A.11 69,13 70.5,11.5 v72,11.5
  Bottom 0.406: v72,11.5 77.5,11.5 86,18.5 86,28 91.96,33.96 ISP_A.7
SCK_B
  Top 0.4: IC_B.17 81.49,58.51 85,55 92.19,55 ISP_B.7
SCL  (via drill 0.6 pad 1.68)
  Top 0.4: IC_B.28 69.84,70.16 v70.5,71
  Top 0.406: IC_A.25 76.4,26.4 78,28 v78,50.5
  Bottom 0.4: v70.5,71 72.5,73 74.5,73 75.55,71.95 R_SCL.2
  Bottom 0.406: 75.5,54.5 R_SCL.2 75.55,52.95 v78,50.5 80,50.5 81.36,49.13 IC_TH.2
SDA  (via drill 0.6 pad 1.68)
  Top 0.4: IC_B.27 70.64,68.64 v73,71 | v76.5,47 76.5,28 75.7,27.2 IC_A.26
  Top 0.406: R_SDA.2 75,48.5 v76.5,47
  Bottom 0.406: v73,71 73,50.5 v76.5,47 80.09,47 IC_TH.1
TX_232_A
  Top 0.4: UART_A.3 53.5,13.5 47.5,19.5 39.5,19.5 37.31,21.69 IC_MAX.14
TX_232_B
  Top 0.4: UART_B.3 21.5,16.5 23.5,18.5 26,18.5
  Top 0.406: 26,18.5 27.15,17.35 IC_MAX.7
TX_UART_A  (via drill 0.6 pad 1.68)
  Top 0.4: IC_A.3 62.6,16.9 v64,15.5
  Bottom 0.4: v64,15.5 64,23.5 60.5,27 32.38,27
  Bottom 0.406: 32.38,27 29.69,24.31 IC_MAX.11
TX_UART_B  (via drill 0.6 pad 1.68)
  Top 0.406: IC_B.31 67.44,67.56 66,69 64.5,69 v62.5,71
  Bottom 0.4: IC_MAX.10 27.15,24.85 11,41 11,59.5 23.5,72 61.5,72 v62.5,71

### Text on the board
Top: B | PC0 | 3 | PD4 | 7 | ISP | A | 5V | ON | UART | OFF | A | B | top
Bottom: bot
Dimension: un calque pour les aligner tous
tRestrict: PA0 | 7 | PC0 | 7 | th | 000 | A | m128 | B | m88 | B | KIE | V1 | 14/06/09 | ~ryder